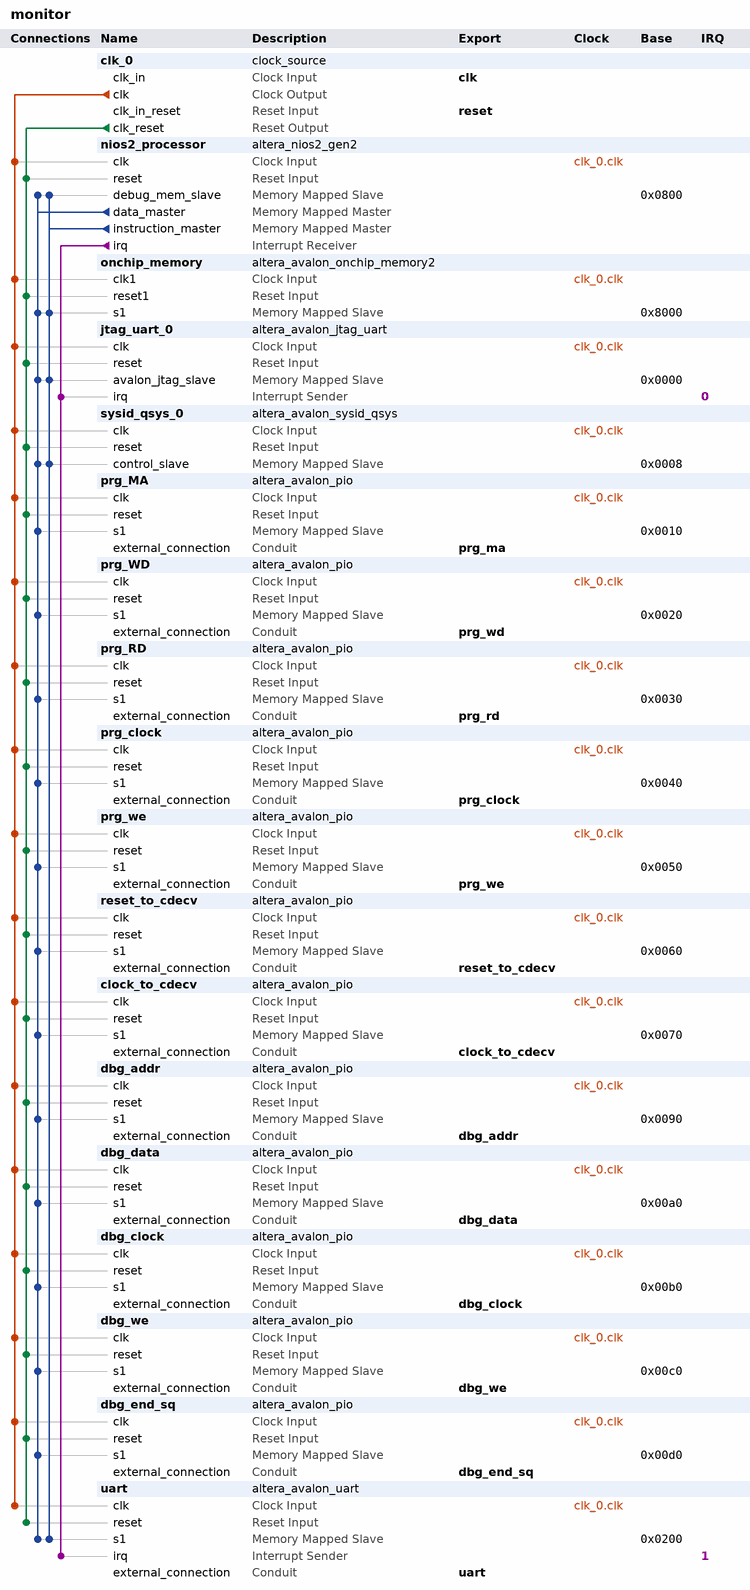
[diagram p0: system contents]
# Platform Designer (Qsys) system monitor, Cyclone V 5CEBA4F23C7
# Parameters at their usual value, and those the tool derives, are not listed.
package require -exact qsys 15.1
create_system monitor
set_project_property DEVICE_FAMILY {Cyclone V}
set_project_property DEVICE 5CEBA4F23C7

add_instance clk_0 clock_source 15.1
set_instance_parameter_value clk_0 clockFrequency 50000000

add_instance nios2_processor altera_nios2_gen2 15.1
set_instance_parameter_value nios2_processor dcache_size 2048
set_instance_parameter_value nios2_processor exceptionSlave onchip_memory.s1
set_instance_parameter_value nios2_processor icache_size 4096
set_instance_parameter_value nios2_processor impl Tiny
set_instance_parameter_value nios2_processor resetSlave onchip_memory.s1

add_instance onchip_memory altera_avalon_onchip_memory2 15.1
set_instance_parameter_value onchip_memory dataWidth 32
set_instance_parameter_value onchip_memory dualPort false
set_instance_parameter_value onchip_memory initMemContent true
set_instance_parameter_value onchip_memory initializationFileName onchip_mem.hex
set_instance_parameter_value onchip_memory memorySize 8192

add_instance jtag_uart_0 altera_avalon_jtag_uart 15.1
set_instance_parameter_value jtag_uart_0 simInteractiveOptions NO_INTERACTIVE_WINDOWS

add_instance sysid_qsys_0 altera_avalon_sysid_qsys 15.1
set_instance_parameter_value sysid_qsys_0 id 65450

add_instance prg_MA altera_avalon_pio 15.1
set_instance_parameter_value prg_MA direction Output
set_instance_parameter_value prg_MA width 8

add_instance prg_WD altera_avalon_pio 15.1
set_instance_parameter_value prg_WD direction Output
set_instance_parameter_value prg_WD width 8

add_instance prg_RD altera_avalon_pio 15.1
set_instance_parameter_value prg_RD direction Input
set_instance_parameter_value prg_RD width 8

add_instance prg_clock altera_avalon_pio 15.1
set_instance_parameter_value prg_clock direction Output
set_instance_parameter_value prg_clock width 1

add_instance prg_we altera_avalon_pio 15.1
set_instance_parameter_value prg_we direction Output
set_instance_parameter_value prg_we width 1

add_instance reset_to_cdecv altera_avalon_pio 15.1
set_instance_parameter_value reset_to_cdecv direction Output
set_instance_parameter_value reset_to_cdecv width 1

add_instance clock_to_cdecv altera_avalon_pio 15.1
set_instance_parameter_value clock_to_cdecv direction Output
set_instance_parameter_value clock_to_cdecv width 1

add_instance dbg_addr altera_avalon_pio 15.1
set_instance_parameter_value dbg_addr direction Output
set_instance_parameter_value dbg_addr width 4

add_instance dbg_data altera_avalon_pio 15.1
set_instance_parameter_value dbg_data direction Input
set_instance_parameter_value dbg_data width 16

add_instance dbg_clock altera_avalon_pio 15.1
set_instance_parameter_value dbg_clock direction Input
set_instance_parameter_value dbg_clock width 1

add_instance dbg_we altera_avalon_pio 15.1
set_instance_parameter_value dbg_we direction Input
set_instance_parameter_value dbg_we width 1

add_instance dbg_end_sq altera_avalon_pio 15.1
set_instance_parameter_value dbg_end_sq direction Input
set_instance_parameter_value dbg_end_sq width 1

add_instance uart altera_avalon_uart 15.1
set_instance_parameter_value uart baud 9600
set_instance_parameter_value uart dataBits 8
set_instance_parameter_value uart fixedBaud true
set_instance_parameter_value uart parity NONE
set_instance_parameter_value uart stopBits 1

# connections
add_connection clk_0.clk clock_to_cdecv.clk clock
add_connection clk_0.clk dbg_addr.clk clock
add_connection clk_0.clk dbg_clock.clk clock
add_connection clk_0.clk dbg_data.clk clock
add_connection clk_0.clk dbg_end_sq.clk clock
add_connection clk_0.clk dbg_we.clk clock
add_connection clk_0.clk jtag_uart_0.clk clock
add_connection clk_0.clk nios2_processor.clk clock
add_connection clk_0.clk onchip_memory.clk1 clock
add_connection clk_0.clk prg_clock.clk clock
add_connection clk_0.clk prg_MA.clk clock
add_connection clk_0.clk prg_RD.clk clock
add_connection clk_0.clk prg_WD.clk clock
add_connection clk_0.clk prg_we.clk clock
add_connection clk_0.clk reset_to_cdecv.clk clock
add_connection clk_0.clk sysid_qsys_0.clk clock
add_connection clk_0.clk uart.clk clock
add_connection clk_0.clk_reset clock_to_cdecv.reset reset
add_connection clk_0.clk_reset dbg_addr.reset reset
add_connection clk_0.clk_reset dbg_clock.reset reset
add_connection clk_0.clk_reset dbg_data.reset reset
add_connection clk_0.clk_reset dbg_end_sq.reset reset
add_connection clk_0.clk_reset dbg_we.reset reset
add_connection clk_0.clk_reset jtag_uart_0.reset reset
add_connection clk_0.clk_reset nios2_processor.reset reset
add_connection clk_0.clk_reset onchip_memory.reset1 reset
add_connection clk_0.clk_reset prg_clock.reset reset
add_connection clk_0.clk_reset prg_MA.reset reset
add_connection clk_0.clk_reset prg_RD.reset reset
add_connection clk_0.clk_reset prg_WD.reset reset
add_connection clk_0.clk_reset prg_we.reset reset
add_connection clk_0.clk_reset reset_to_cdecv.reset reset
add_connection clk_0.clk_reset sysid_qsys_0.reset reset
add_connection clk_0.clk_reset uart.reset reset
add_connection nios2_processor.data_master clock_to_cdecv.s1 avalon
set_connection_parameter_value nios2_processor.data_master/clock_to_cdecv.s1 baseAddress 0x0070
add_connection nios2_processor.data_master dbg_addr.s1 avalon
set_connection_parameter_value nios2_processor.data_master/dbg_addr.s1 baseAddress 0x0090
add_connection nios2_processor.data_master dbg_clock.s1 avalon
set_connection_parameter_value nios2_processor.data_master/dbg_clock.s1 baseAddress 0x00b0
add_connection nios2_processor.data_master dbg_data.s1 avalon
set_connection_parameter_value nios2_processor.data_master/dbg_data.s1 baseAddress 0x00a0
add_connection nios2_processor.data_master dbg_end_sq.s1 avalon
set_connection_parameter_value nios2_processor.data_master/dbg_end_sq.s1 baseAddress 0x00d0
add_connection nios2_processor.data_master dbg_we.s1 avalon
set_connection_parameter_value nios2_processor.data_master/dbg_we.s1 baseAddress 0x00c0
add_connection nios2_processor.data_master jtag_uart_0.avalon_jtag_slave avalon
set_connection_parameter_value nios2_processor.data_master/jtag_uart_0.avalon_jtag_slave baseAddress 0x0000
add_connection nios2_processor.data_master nios2_processor.debug_mem_slave avalon
set_connection_parameter_value nios2_processor.data_master/nios2_processor.debug_mem_slave baseAddress 0x0800
add_connection nios2_processor.data_master onchip_memory.s1 avalon
set_connection_parameter_value nios2_processor.data_master/onchip_memory.s1 baseAddress 0x8000
add_connection nios2_processor.data_master prg_clock.s1 avalon
set_connection_parameter_value nios2_processor.data_master/prg_clock.s1 baseAddress 0x0040
add_connection nios2_processor.data_master prg_MA.s1 avalon
set_connection_parameter_value nios2_processor.data_master/prg_MA.s1 baseAddress 0x0010
add_connection nios2_processor.data_master prg_RD.s1 avalon
set_connection_parameter_value nios2_processor.data_master/prg_RD.s1 baseAddress 0x0030
add_connection nios2_processor.data_master prg_WD.s1 avalon
set_connection_parameter_value nios2_processor.data_master/prg_WD.s1 baseAddress 0x0020
add_connection nios2_processor.data_master prg_we.s1 avalon
set_connection_parameter_value nios2_processor.data_master/prg_we.s1 baseAddress 0x0050
add_connection nios2_processor.data_master reset_to_cdecv.s1 avalon
set_connection_parameter_value nios2_processor.data_master/reset_to_cdecv.s1 baseAddress 0x0060
add_connection nios2_processor.data_master sysid_qsys_0.control_slave avalon
set_connection_parameter_value nios2_processor.data_master/sysid_qsys_0.control_slave baseAddress 0x0008
add_connection nios2_processor.data_master uart.s1 avalon
set_connection_parameter_value nios2_processor.data_master/uart.s1 baseAddress 0x0200
add_connection nios2_processor.instruction_master jtag_uart_0.avalon_jtag_slave avalon
set_connection_parameter_value nios2_processor.instruction_master/jtag_uart_0.avalon_jtag_slave baseAddress 0x0000
add_connection nios2_processor.instruction_master nios2_processor.debug_mem_slave avalon
set_connection_parameter_value nios2_processor.instruction_master/nios2_processor.debug_mem_slave baseAddress 0x0800
add_connection nios2_processor.instruction_master onchip_memory.s1 avalon
set_connection_parameter_value nios2_processor.instruction_master/onchip_memory.s1 baseAddress 0x8000
add_connection nios2_processor.instruction_master sysid_qsys_0.control_slave avalon
set_connection_parameter_value nios2_processor.instruction_master/sysid_qsys_0.control_slave baseAddress 0x0008
add_connection nios2_processor.instruction_master uart.s1 avalon
set_connection_parameter_value nios2_processor.instruction_master/uart.s1 baseAddress 0x0200
add_connection nios2_processor.irq jtag_uart_0.irq interrupt
set_connection_parameter_value nios2_processor.irq/jtag_uart_0.irq irqNumber 0
add_connection nios2_processor.irq uart.irq interrupt
set_connection_parameter_value nios2_processor.irq/uart.irq irqNumber 1

# exported interfaces
add_interface clk clock sink
set_interface_property clk EXPORT_OF clk_0.clk_in
add_interface clock_to_cdecv conduit end
set_interface_property clock_to_cdecv EXPORT_OF clock_to_cdecv.external_connection
add_interface dbg_addr conduit end
set_interface_property dbg_addr EXPORT_OF dbg_addr.external_connection
add_interface dbg_clock conduit end
set_interface_property dbg_clock EXPORT_OF dbg_clock.external_connection
add_interface dbg_data conduit end
set_interface_property dbg_data EXPORT_OF dbg_data.external_connection
add_interface dbg_end_sq conduit end
set_interface_property dbg_end_sq EXPORT_OF dbg_end_sq.external_connection
add_interface dbg_we conduit end
set_interface_property dbg_we EXPORT_OF dbg_we.external_connection
add_interface prg_clock conduit end
set_interface_property prg_clock EXPORT_OF prg_clock.external_connection
add_interface prg_ma conduit end
set_interface_property prg_ma EXPORT_OF prg_MA.external_connection
add_interface prg_rd conduit end
set_interface_property prg_rd EXPORT_OF prg_RD.external_connection
add_interface prg_wd conduit end
set_interface_property prg_wd EXPORT_OF prg_WD.external_connection
add_interface prg_we conduit end
set_interface_property prg_we EXPORT_OF prg_we.external_connection
add_interface reset reset sink
set_interface_property reset EXPORT_OF clk_0.clk_in_reset
add_interface reset_to_cdecv conduit end
set_interface_property reset_to_cdecv EXPORT_OF reset_to_cdecv.external_connection
add_interface uart conduit end
set_interface_property uart EXPORT_OF uart.external_connection

set_interconnect_requirement {$system} qsys_mm.clockCrossingAdapter HANDSHAKE
set_interconnect_requirement {$system} qsys_mm.enableEccProtection FALSE
set_interconnect_requirement {$system} qsys_mm.insertDefaultSlave FALSE
set_interconnect_requirement {$system} qsys_mm.maxAdditionalLatency 1

save_system monitor.qsys
